# EAGLE design RNS (EAGLE 9.5.1)
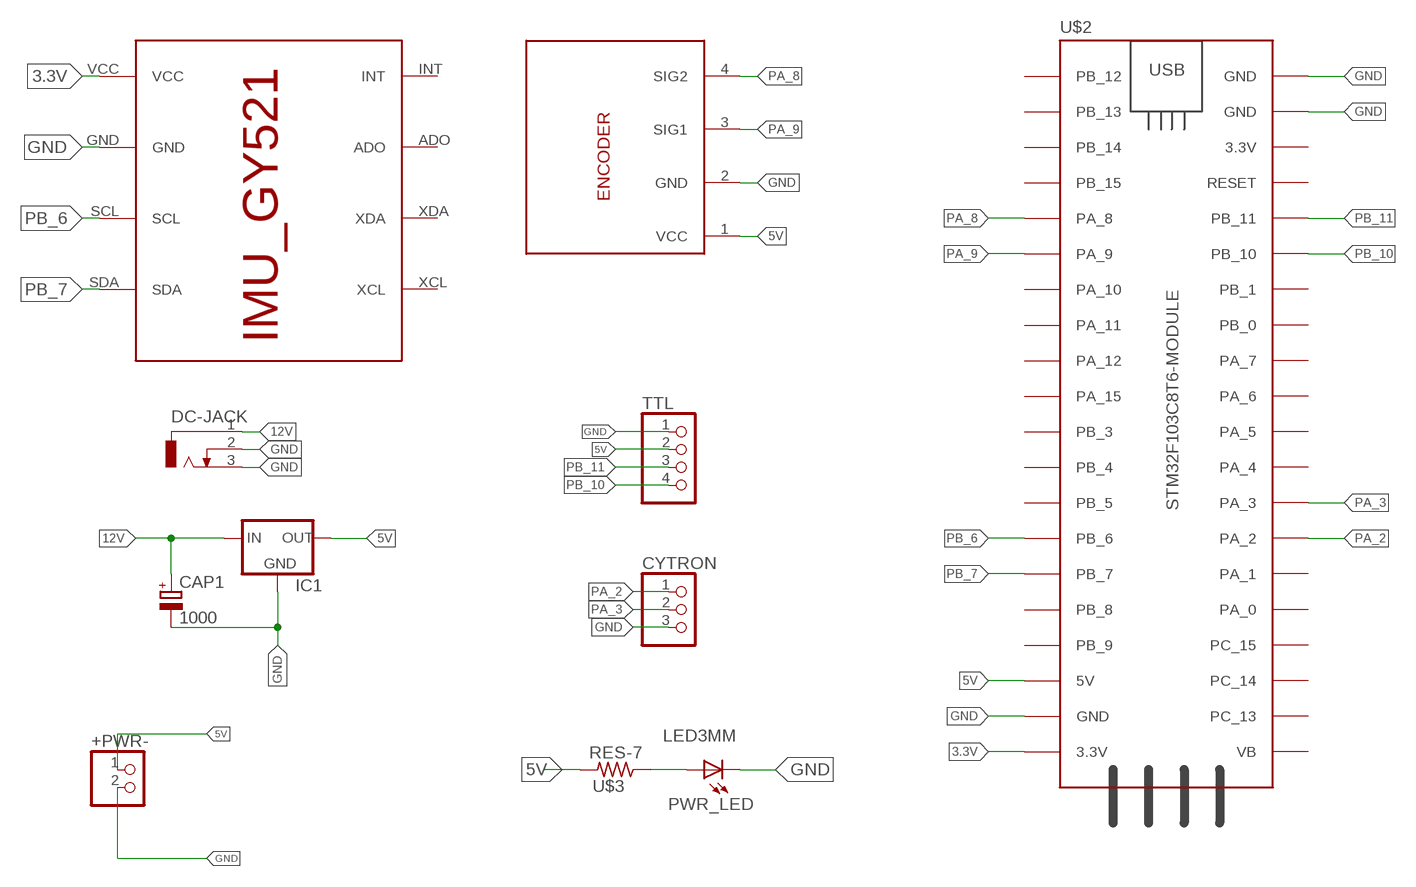
[diagram p0: schematic, sheet 1]

## Parts
+PWR-  PINHD-1X2  [1X02]
CAP1  1000  CAP_POL  [E3,5-8]
CYTRON  PINHD-1X3  [1X03]
DC-JACK  CON_JACK  [DCJ0303]
IC1  78XXL  [78XXL]
PWR_LED  LED3MM  [LED3MM]
TTL  PINHD-1X4  [1X04]
U$1  ENCODER  [1X04_DATA]
U$2  STM32F103C8T6-MODULE  [STM32F103C8T6-MODULE]
U$3  RES-7  [0204/7]
U$4  IMU_ROBOCON_GY521  [IMU_GY521]

## Nets
3.3V: U$2.3.3V_1(3.3V) U$4.VCC
5V: +PWR-.1 IC1.OUT TTL.2 U$1.1(VCC) U$2.5V U$3.2
12V: CAP1.+ DC-JACK.1 IC1.IN
A: PWR_LED.A U$3.1
GND: +PWR-.2 CAP1.- CYTRON.3 DC-JACK.2 DC-JACK.3 IC1.GND PWR_LED.K(C) TTL.1 U$1.2(GND) U$2.GND_1(GND) U$2.GND_2(GND) U$2.GND_3(GND) U$4.GND
PA_2: CYTRON.1 U$2.PA_2
PA_3: CYTRON.2 U$2.PA_3
PA_8: U$1.4(SIG2) U$2.PA_8
PA_9: U$1.3(SIG1) U$2.PA_9
PB_6: U$2.PB_6 U$4.SCL
PB_7: U$2.PB_7 U$4.SDA
PB_10: TTL.4 U$2.PB_10
PB_11: TTL.3 U$2.PB_11
Unconnected: U$2.3.3V_2(3.3V) U$2.PA_0 U$2.PA_1 U$2.PA_4 U$2.PA_5 U$2.PA_6 U$2.PA_7 U$2.PA_10 U$2.PA_11 U$2.PA_12 U$2.PA_15 U$2.PB_0 U$2.PB_1 U$2.PB_3 U$2.PB_4 U$2.PB_5 U$2.PB_8 U$2.PB_9 U$2.PB_12 U$2.PB_13 U$2.PB_14 U$2.PB_15 U$2.PC_13 U$2.PC_14 U$2.PC_15 U$2.RESET U$2.VB U$4.ADO U$4.INT U$4.XCL U$4.XDA

## Library data of the parts
+PWR- = MIA_LIBRARY-2-2-2:PINHD-1X2: PIN HEADER
CAP1 = MIA_LIBRARY-2-2-2:CAP_POL
CYTRON = MIA_LIBRARY-2-2-2:PINHD-1X3: PIN HEADER
DC-JACK = MIA_LIBRARY-2-2-2:CON_JACK: DC POWER JACK Source: DCJ0303.pdf; OC_FARNELL: unknown; OC_NEWARK: unknown
IC1 = MIA_LIBRARY-2-2-2:78XXL: VOLTAGE REGULATOR
PWR_LED = MIA_LIBRARY-2-2-2:LED3MM
TTL = MIA_LIBRARY-2-2-2:PINHD-1X4: PIN HEADER
U$1 = MIA_LIBRARY-2-2-2:ENCODER
U$2 = MIA_LIBRARY-2-2-2:STM32F103C8T6-MODULE: STM32F103C8T6 module with ARM Cortex-3, 20kB SRAM, 64kB Flash, 72MHz
U$3 = MIA_LIBRARY-2-2-2:RES-7
U$4 = MIA_LIBRARY-2-2-2:IMU_ROBOCON_GY521

## Board
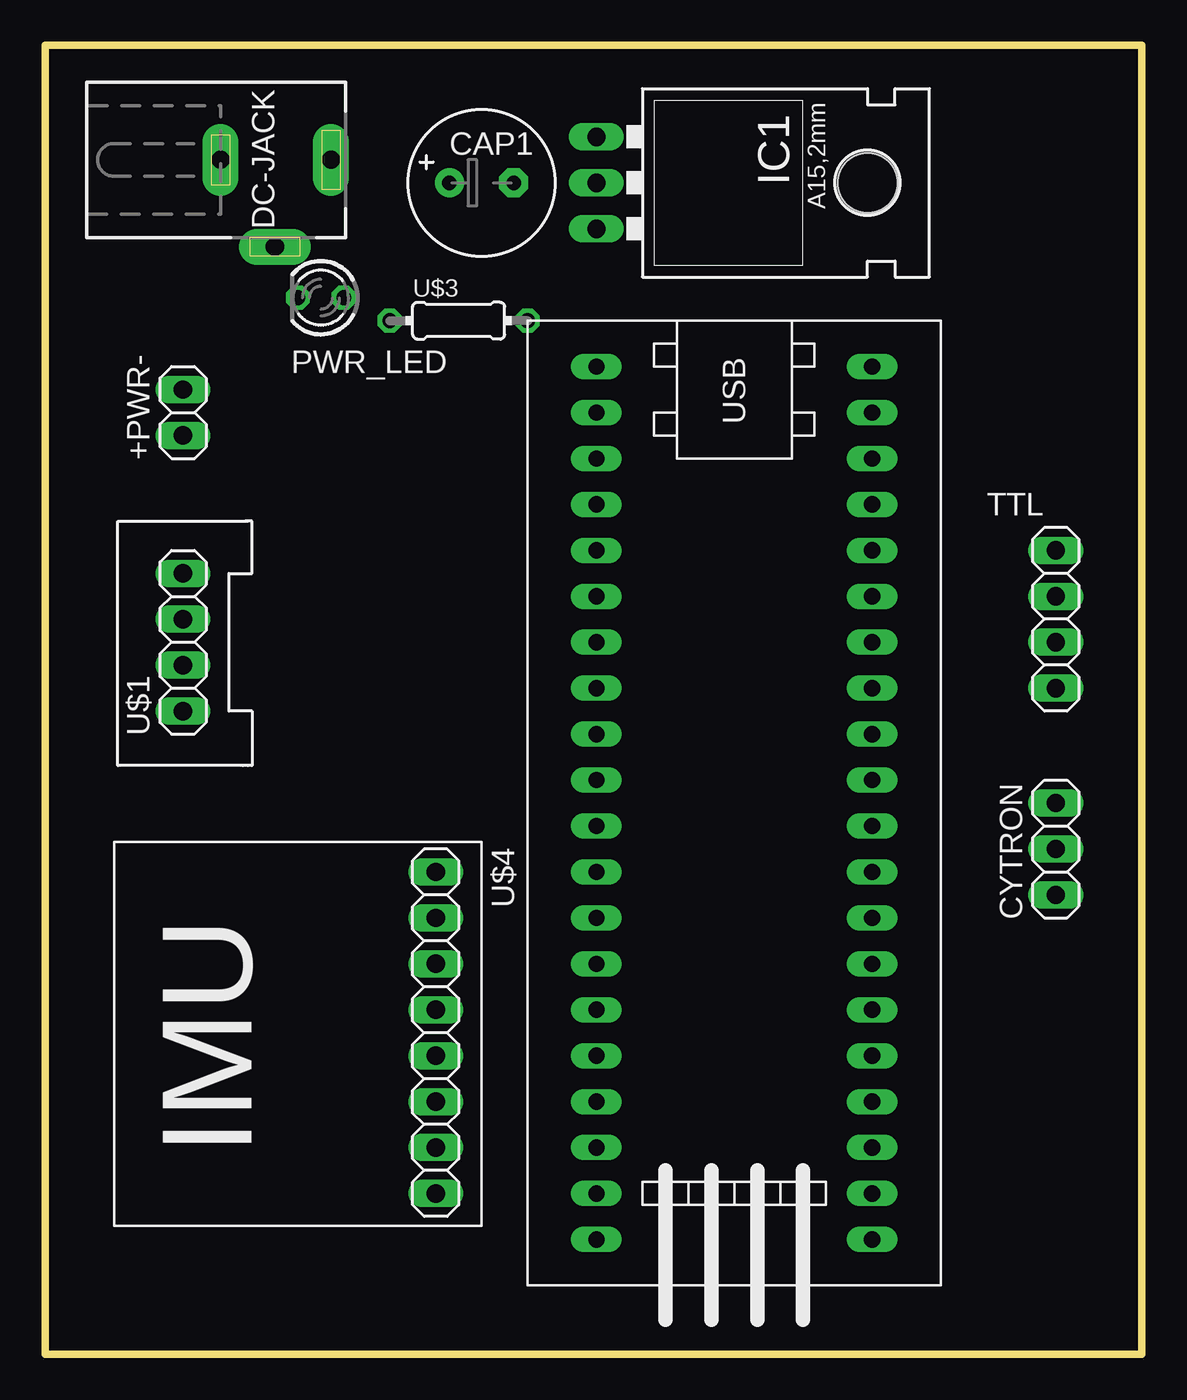
[diagram p1: board, top side]
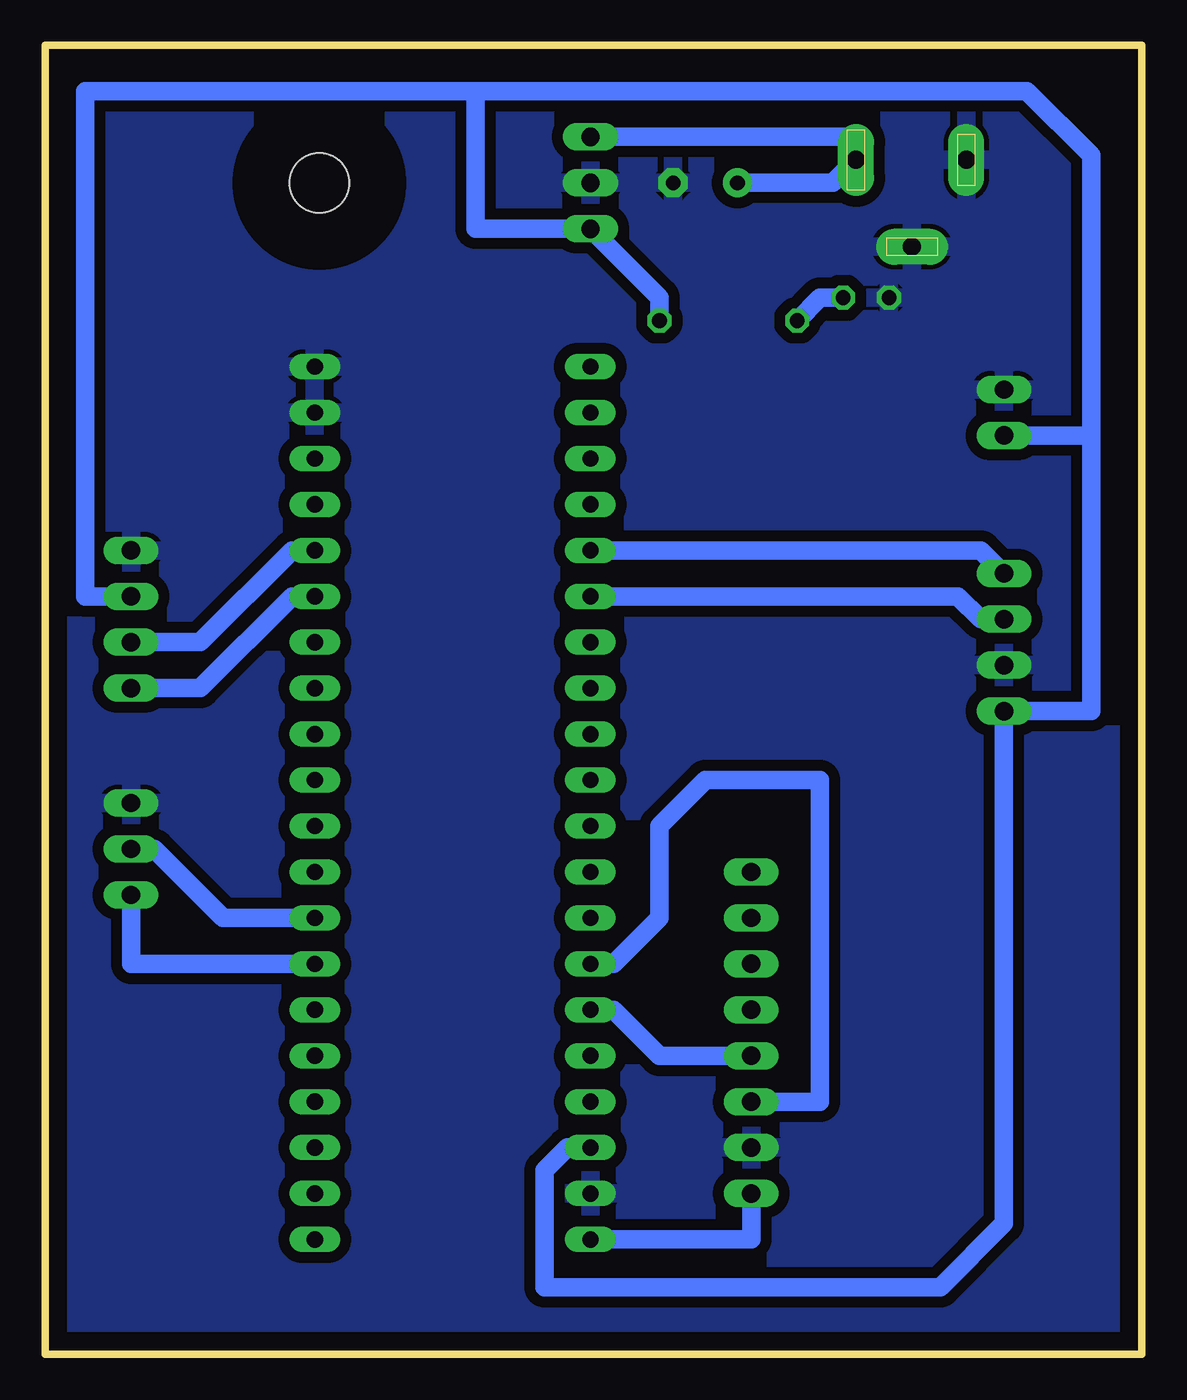
[diagram p2: board, bottom side, seen from below]

Size 60.63 x 72.38 mm. Coordinates in mm from the lower left corner, seen from the top.
Outline: 0,0 60.63,0 60.63,72.38 0,72.38 0,0
Copper layers (1*16): Top 0.035mm / dielectric 1.5mm / Bottom 0.035mm
Design rules "default": minimum track width 6mil, minimum drill 0.35mm, track to track 6mil, track to pad 6mil, pad to pad 6mil, via to via 6mil, smd to smd 6mil, copper to edge 40mil, drill to drill 6mil, minimum pad ring 10mil, minimum via ring 8mil, stop-mask expansion 4mil, vias tented up to drill 0mil, thermal gap 10mil

### Footprints (pad centres in the part's own frame; a part is rotated, then mirrored left to right if it is on the bottom)
1X02 = drill 1.016 long: 1 -1.27,0; 2 1.27,0
E3,5-8 = drill 0.813 pad 1.6: + -1.778,0 | drill 0.813 pad 1.6 octagon: - 1.778,0
1X03 = drill 1.016 long: 1 -2.54,0; 2 0,0; 3 2.54,0
DCJ0303 = drill 1 pad 2 long: 1 0,3.1; 2 4.8,0; 3 0,-3
78XXL = drill 1.016 long: GND 0,-3.81; IN -2.54,-3.81; OUT 2.54,-3.81 | hole 3.302: 0,11.176
LED3MM = drill 0.813 octagon: A -1.27,0; K 1.27,0
1X04 = drill 1.016 long: 1 -3.81,0; 2 -1.27,0; 3 1.27,0; 4 3.81,0
1X04_DATA = drill 1.016 long: 1 -3.81,0; 2 -1.27,0; 3 1.27,0; 4 3.81,0
STM32F103C8T6-MODULE = drill 0.9 long: 3.3V_1 25.4,-7.62; 3.3V_2 -17.78,7.62; 5V 20.32,-7.62; GND_1 22.86,-7.62; GND_2 -20.32,7.62; GND_3 -22.86,7.62; PA_0 15.24,7.62; PA_1 12.7,7.62; PA_2 10.16,7.62; PA_3 7.62,7.62; PA_4 5.08,7.62; PA_5 2.54,7.62; PA_6 0,7.62; PA_7 -2.54,7.62; PA_8 -12.7,-7.62; PA_9 -10.16,-7.62; PA_10 -7.62,-7.62; PA_11 -5.08,-7.62; PA_12 -2.54,-7.62; PA_15 0,-7.62; PB_0 -5.08,7.62; PB_1 -7.62,7.62; PB_3 2.54,-7.62; PB_4 5.08,-7.62; PB_5 7.62,-7.62; PB_6 10.16,-7.62; PB_7 12.7,-7.62; PB_8 15.24,-7.62; PB_9 17.78,-7.62; PB_10 -10.16,7.62; PB_11 -12.7,7.62; PB_12 -22.86,-7.62; PB_13 -20.32,-7.62; PB_14 -17.78,-7.62; PB_15 -15.24,-7.62; PC_13 22.86,7.62; PC_14 20.32,7.62; PC_15 17.78,7.62; RESET -15.24,7.62; VB 25.4,7.62
0204/7 = drill 0.813 octagon: 1 -3.81,0; 2 3.81,0
IMU_GY521 = drill 1.016 long: ADO -6.35,0; GND 6.35,0; INT -8.89,0; SCL 3.81,0; SDA 1.27,0; VCC 8.89,0; XCL -3.81,0; XDA -1.27,0

### Placement (x,y rotation side)
+PWR-  7.62,52.07 90 top
CAP1  24.13,64.77 0 top
CYTRON  55.88,27.94 90 top
DC-JACK  12.7,66.04 270 top
IC1  34.29,64.77 270 top
PWR_LED  15.24,58.42 180 top
TTL  55.88,40.64 270 top
U$1  7.62,39.37 90 top
U$2  38.1,31.75 270 top
U$3  22.86,57.15 0 top
U$4  21.59,17.78 270 top

### Tracks (layer width: path | path; a pad name or v marks a point on that pad's centre or on a via)
3.3V
  Bottom 1.016: U$4.VCC 21.59,6.35 U$2.3.3V_1
5V
  Bottom 1.016: U$2.5V 31.75,11.43 33.02,10.16 33.02,3.72 11.14,3.72 7.62,7.24 U$1.1 2.79,35.56 2.79,50.8 | 36.83,69.85 36.83,62.23 IC1.OUT 26.67,58.42 U$3.2 | 36.83,69.85 6.35,69.85 2.79,66.29 2.79,50.8 | TTL.2 58.42,41.91 58.42,69.85 36.83,69.85 | +PWR-.1 2.79,50.8
12V
  Bottom 1.016: IC1.IN 16.51,67.31 15.8,66.6 DC-JACK.1 17.07,64.77 CAP1.+
A
  Bottom 1.016: U$3.1 17.78,58.42 PWR_LED.A
GND
  pour Bottom (isolate 0.61): 0,72.39 60.96,72.39 60.96,0 0,0
PA_2
  Bottom 1.016: CYTRON.1 55.88,21.59 U$2.PA_2
PA_3
  Bottom 1.016: CYTRON.2 54.61,27.94 50.8,24.13 U$2.PA_3
PA_8
  Bottom 1.016: U$2.PA_8 8.89,44.45 U$1.4
PA_9
  Bottom 1.016: U$1.3 8.89,40.64 10.16,41.91 U$2.PA_9
PB_6
  Bottom 1.016: U$4.SCL 17.78,13.97 17.78,31.75 24.13,31.75 26.67,29.21 26.67,24.13 29.21,21.59 U$2.PB_6
PB_7
  Bottom 1.016: U$2.PB_7 29.21,19.05 26.67,16.51 U$4.SDA
PB_10
  Bottom 1.016: TTL.4 52.07,36.83 46.99,41.91 U$2.PB_10
PB_11
  Bottom 1.016: TTL.3 52.07,39.37 46.99,44.45 U$2.PB_11